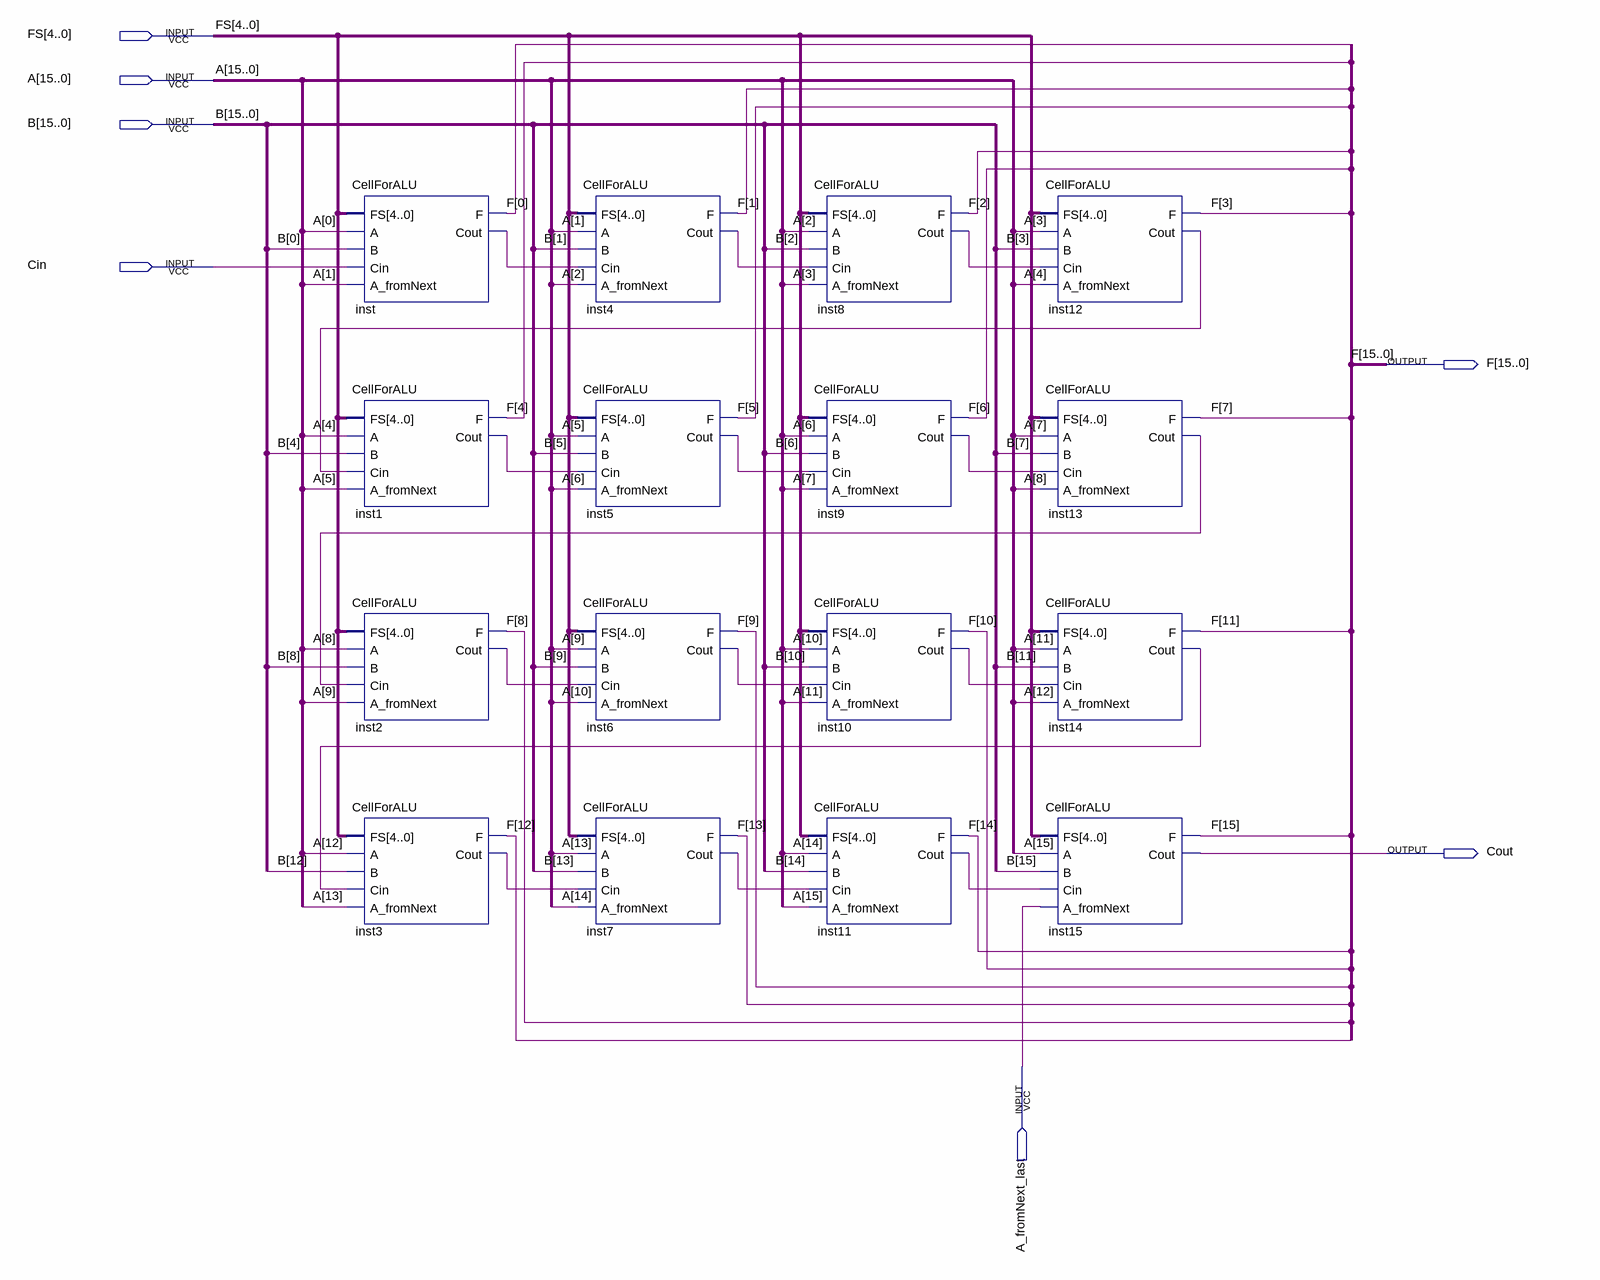
[diagram p0: schematic sheet]
// Quartus schematic ALU.bdf as structural Verilog: 16 symbols, 7 pins
module ALU (
  input  [4:0] FS,
  input  [15:0] A,
  input  [15:0] B,
  input  Cin,
  input  A_fromNext_last,
  output [15:0] F,
  output Cout
);

  wire inst1_cout, inst2_cout, inst3_cout, inst4_cout, inst5_cout, inst6_cout, inst7_cout, inst8_cout,
       inst9_cout, inst10_cout, inst11_cout, inst12_cout, inst13_cout, inst14_cout, inst_cout;

  CellForALU inst (.FS(FS), .A(A[0]), .B(B[0]), .Cin(Cin), .A_fromNext(A[1]), .F(F[0]), .Cout(inst_cout));
  CellForALU inst1 (.FS(FS), .A(A[4]), .B(B[4]), .Cin(inst12_cout), .A_fromNext(A[5]), .F(F[4]), .Cout(inst1_cout));
  CellForALU inst2 (.FS(FS), .A(A[8]), .B(B[8]), .Cin(inst13_cout), .A_fromNext(A[9]), .F(F[8]), .Cout(inst2_cout));
  CellForALU inst3 (.FS(FS), .A(A[12]), .B(B[12]), .Cin(inst14_cout), .A_fromNext(A[13]), .F(F[12]), .Cout(inst3_cout));
  CellForALU inst4 (.FS(FS), .A(A[1]), .B(B[1]), .Cin(inst_cout), .A_fromNext(A[2]), .F(F[1]), .Cout(inst4_cout));
  CellForALU inst5 (.FS(FS), .A(A[5]), .B(B[5]), .Cin(inst1_cout), .A_fromNext(A[6]), .F(F[5]), .Cout(inst5_cout));
  CellForALU inst6 (.FS(FS), .A(A[9]), .B(B[9]), .Cin(inst2_cout), .A_fromNext(A[10]), .F(F[9]), .Cout(inst6_cout));
  CellForALU inst7 (.FS(FS), .A(A[13]), .B(B[13]), .Cin(inst3_cout), .A_fromNext(A[14]), .F(F[13]), .Cout(inst7_cout));
  CellForALU inst8 (.FS(FS), .A(A[2]), .B(B[2]), .Cin(inst4_cout), .A_fromNext(A[3]), .F(F[2]), .Cout(inst8_cout));
  CellForALU inst9 (.FS(FS), .A(A[6]), .B(B[6]), .Cin(inst5_cout), .A_fromNext(A[7]), .F(F[6]), .Cout(inst9_cout));
  CellForALU inst10 (
    .FS(FS), .A(A[10]), .B(B[10]), .Cin(inst6_cout), .A_fromNext(A[11]), .F(F[10]), .Cout(inst10_cout));
  CellForALU inst11 (
    .FS(FS), .A(A[14]), .B(B[14]), .Cin(inst7_cout), .A_fromNext(A[15]), .F(F[14]), .Cout(inst11_cout));
  CellForALU inst12 (.FS(FS), .A(A[3]), .B(B[3]), .Cin(inst8_cout), .A_fromNext(A[4]), .F(F[3]), .Cout(inst12_cout));
  CellForALU inst13 (.FS(FS), .A(A[7]), .B(B[7]), .Cin(inst9_cout), .A_fromNext(A[8]), .F(F[7]), .Cout(inst13_cout));
  CellForALU inst14 (
    .FS(FS), .A(A[11]), .B(B[11]), .Cin(inst10_cout), .A_fromNext(A[12]), .F(F[11]), .Cout(inst14_cout));
  CellForALU inst15 (
    .FS(FS), .A(A[15]), .B(B[15]), .Cin(inst11_cout), .A_fromNext(A_fromNext_last), .F(F[15]), .Cout(Cout));
endmodule
